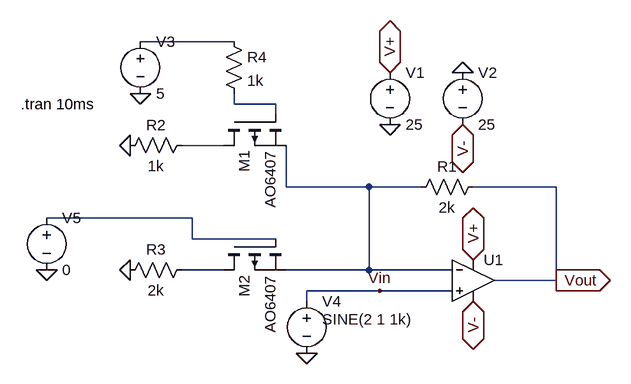
[diagram p0: schematic OpAmpGainControlPNP.asc]
OpAmpGainControlPNP.asc, the LTspice schematic file:
Version 4
SHEET 1 880 680
WIRE -496 -320 -640 -320
WIRE -496 -224 -496 -240
WIRE -432 -224 -496 -224
WIRE -432 -208 -432 -224
WIRE -512 -160 -576 -160
WIRE -416 -96 -416 -160
WIRE -288 -96 -416 -96
WIRE -208 -96 -288 -96
WIRE 0 -96 -128 -96
WIRE -560 -48 -784 -48
WIRE -560 -16 -560 -48
WIRE -432 -16 -560 -16
WIRE -512 32 -576 32
WIRE -288 32 -288 -96
WIRE -288 32 -416 32
WIRE -160 32 -288 32
WIRE 0 48 0 -96
WIRE 0 48 -96 48
WIRE -272 64 -384 64
WIRE -160 64 -272 64
WIRE -384 80 -384 64
FLAG -256 -192 0
FLAG -256 -272 V+
IOPIN -256 -272 BiDir
FLAG -144 -192 V-
IOPIN -144 -192 BiDir
FLAG -144 -272 0
FLAG -128 16 V+
IOPIN -128 16 BiDir
FLAG -128 80 V-
IOPIN -128 80 BiDir
FLAG -384 160 0
FLAG -656 -160 0
FLAG 0 48 Vout
IOPIN 0 48 Out
FLAG -656 32 0
FLAG -640 -240 0
FLAG -784 32 0
FLAG -272 64 Vin
DATAFLAG -32 48 ""
SYMBOL OpAmps\\UniversalOpAmp -128 48 R0
SYMATTR InstName U1
SYMBOL voltage -256 -288 R0
SYMATTR InstName V1
SYMATTR Value 25
SYMBOL voltage -144 -288 R0
SYMATTR InstName V2
SYMATTR Value 25
SYMBOL voltage -384 64 R0
WINDOW 3 24 44 Left 2
WINDOW 123 0 0 Left 0
WINDOW 39 0 0 Left 0
SYMATTR Value SINE(2 1 1k)
SYMATTR InstName V4
SYMBOL res -112 -112 R90
WINDOW 0 0 56 VBottom 2
WINDOW 3 32 56 VTop 2
SYMATTR InstName R1
SYMATTR Value 2k
SYMBOL pmos -512 -208 M90
SYMATTR InstName M1
SYMATTR Value AO6407
SYMBOL res -560 -176 R90
WINDOW 0 0 56 VBottom 2
WINDOW 3 32 56 VTop 2
SYMATTR InstName R2
SYMATTR Value 1k
SYMBOL pmos -512 -16 M90
SYMATTR InstName M2
SYMATTR Value AO6407
SYMBOL res -560 16 R90
WINDOW 0 0 56 VBottom 2
WINDOW 3 32 56 VTop 2
SYMATTR InstName R3
SYMATTR Value 2k
SYMBOL voltage -640 -336 R0
SYMATTR InstName V3
SYMATTR Value 5
SYMBOL voltage -784 -64 R0
SYMATTR InstName V5
SYMATTR Value 0
SYMBOL res -512 -336 R0
SYMATTR InstName R4
SYMATTR Value 1k
TEXT -824 -224 Left 2 !.tran 10ms

The netlist it stands for:
* OpAmpGainControlPNP.asc
XU1 Vin N004 V+ V- Vout level1 Avol=1Meg GBW=10Meg Vos=0 En=0 Enk=0 In=0 Ink=0 Rin=500Meg  ; pins In+ In- V+ V- OUT
V1 V+ 0 25
V2 0 V- 25
V4 Vin 0 SINE(2 1 1k)
R1 Vout N004 2k
M1 N003 N002 N004 N004 AO6407
R2 N003 0 1k
M2 N006 N005 N004 N004 AO6407
R3 N006 0 2k
V3 N001 0 5
V5 N005 0 0
R4 N001 N002 1k
.model NMOS NMOS
.model PMOS PMOS
.lib standard.mos
.tran 10ms
.lib UniversalOpAmp1.lib
.backanno
.end